# EAGLE schematic integratorSchmidtTriggerOsc (EAGLE 7.7.0)
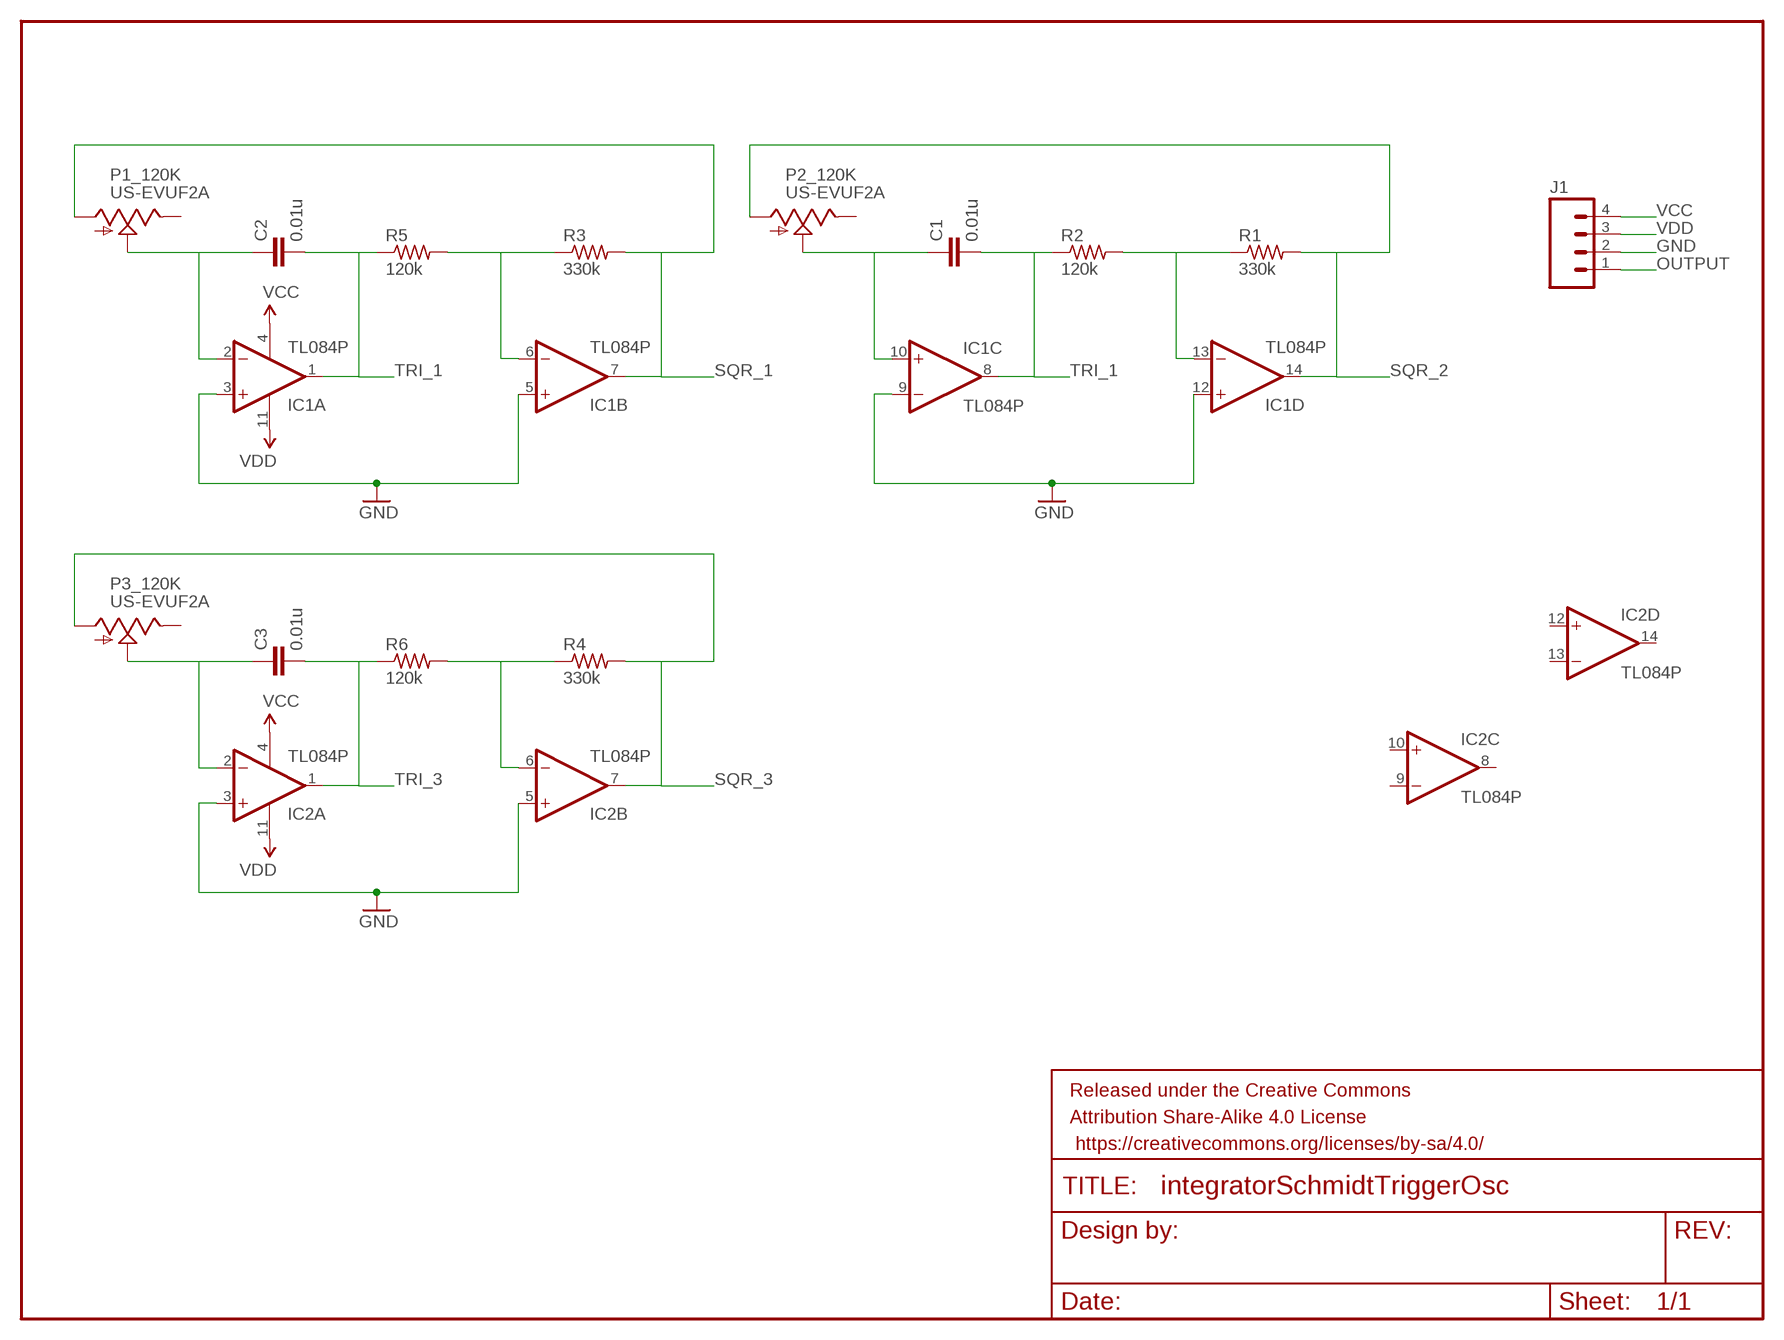
[diagram p0: schematic, sheet 1]

## Parts
C1  0.01u  CAP_  [AXIAL-5MM]
C2  0.01u  CAP_  [AXIAL-5MM]
C3  0.01u  CAP_  [AXIAL-5MM]
FRAME1  FRAME-LETTERNO_PACKAGE  [DUMMY]
IC1  TL084P  [DIL14]
IC2  TL084P  [DIL14]
J1  M04NO_SILK_ALL_ROUND  [1X04_NO_SILK_ALL_ROUND]
P1_120K  US-EVUF2A  [EVUF]
P2_120K  US-EVUF2A  [EVUF]
P3_120K  US-EVUF2A  [EVUF]
R1  330k  R-US_0204/7  [0204/7]
R2  120k  R-US_0204/7  [0204/7]
R3  330k  R-US_0204/7  [0204/7]
R4  330k  R-US_0204/7  [0204/7]
R5  120k  R-US_0204/7  [0204/7]
R6  120k  R-US_0204/7  [0204/7]

## Nets
GND: IC1.3(A:+IN) IC1.5(B:+IN) IC1.9(C:-IN) IC1.12(D:+IN) IC2.3(A:+IN) IC2.5(B:+IN) J1.2
N$1: C2.P$1 IC1.2(A:-IN) P1_120K.2(S)
N$2: C1.P$1 IC1.10(C:+IN) P2_120K.2(S)
N$3: IC1.13(D:-IN) R1.1 R2.2
N$4: IC1.6(B:-IN) R3.1 R5.2
N$5: C3.P$1 IC2.2(A:-IN) P3_120K.2(S)
N$6: IC2.6(B:-IN) R4.1 R6.2
OUTPUT: J1.1
SQR_1: IC1.7(B:OUT) P1_120K.1(A) R3.2
SQR_2: IC1.14(D:OUT) P2_120K.1(A) R1.2
SQR_3: IC2.7(B:OUT) P3_120K.1(A) R4.2
TRI_1: C1.P$2 C2.P$2 IC1.1(A:OUT) IC1.8(C:OUT) R2.1 R5.1
TRI_3: C3.P$2 IC2.1(A:OUT) R6.1
VCC: IC1.4(P:V+) IC2.4(P:V+) J1.4
VDD: IC1.11(P:V-) IC2.11(P:V-) J1.3
Unconnected: IC2.8(C:OUT) IC2.9(C:-IN) IC2.10(C:+IN) IC2.12(D:+IN) IC2.13(D:-IN) IC2.14(D:OUT) P1_120K.3(E) P2_120K.3(E) P3_120K.3(E)

## Library data of the parts
C1-C3 = SparkFun-Capacitors:CAP: Capacitor Standard 0603 ceramic capacitor, and 0.1" leaded capacitor.
FRAME1 = SparkFun-Aesthetics:FRAME-LETTER: Schematic Frame Standard 8.5x11 US Letter frame; DESIGNER: Nobody; VERSION: v01
IC1 IC2 = linear:TL084: OP AMP
J1 = SparkFun-Connectors:M04: Header 4 Standard 4-pin 0.1" header. Use with straight break away headers (SKU : PRT-00116), right angle break away headers (PRT-00553), swiss pins (PRT-00743), machine pins (PRT-00117), and female headers (PRT-00115). Molex polarized connector foot print use with SKU : PRT-08231 with associated crimp pins and housings. 1MM SMD Version SKU: PRT-10208; PROD_ID: CONN-09696
P1_120K P2_120K P3_120K = pot:US-EVU: 9 mm Square Rotary Potentiometers Source: Panasonic
R1-R6 = adafruit:R-US_: RESISTOR, American symbol

## Net classes
0 default: width 0.406 mm, clearance 0.305 mm